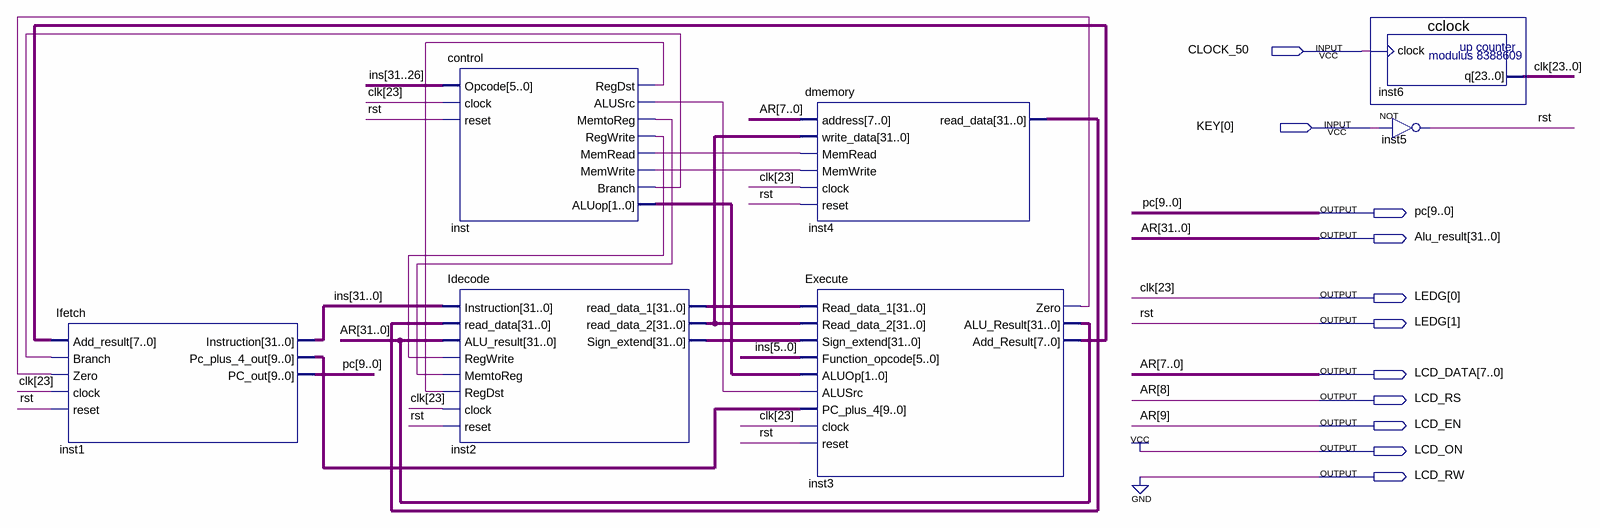
[diagram p0: schematic sheet]
// Quartus schematic MIPS.bdf as structural Verilog: 7 symbols, 11 pins
module MIPS (
  input  CLOCK_50,
  input  [0:0] KEY,
  output [9:0] pc,
  output [31:0] Alu_result,
  output [1:0] LEDG,
  output [7:0] LCD_DATA,
  output LCD_RS,
  output LCD_EN,
  output LCD_ON,
  output LCD_RW
);

  wire inst3_zero, inst_alusrc, inst_branch, inst_memread, inst_memtoreg, inst_memwrite, inst_regdst,
       inst_regwrite;
  wire [1:0] inst_aluop;
  wire [7:0] inst3_add_result;
  wire [9:0] inst1_pc_plus_4_out;
  wire [22:0] clk;
  wire [31:0] ins, inst2_read_data_1, inst2_read_data_2, inst2_sign_extend, inst4_read_data;

  Ifetch inst1 (
    .Add_result(inst3_add_result), .Branch(inst_branch), .Zero(inst3_zero), .clock(LEDG[0]), .reset(LEDG[1]),
    .Instruction(ins), .Pc_plus_4_out(inst1_pc_plus_4_out), .PC_out(pc));
  control inst (
    .Opcode(ins[31:26]), .clock(LEDG[0]), .reset(LEDG[1]), .RegDst(inst_regdst), .ALUSrc(inst_alusrc),
    .MemtoReg(inst_memtoreg), .RegWrite(inst_regwrite), .MemRead(inst_memread), .MemWrite(inst_memwrite),
    .Branch(inst_branch), .ALUop(inst_aluop));
  Idecode inst2 (
    .Instruction(ins), .read_data(inst4_read_data), .ALU_result(Alu_result), .RegWrite(inst_regwrite),
    .MemtoReg(inst_memtoreg), .RegDst(inst_regdst), .clock(LEDG[0]), .reset(LEDG[1]),
    .read_data_1(inst2_read_data_1), .read_data_2(inst2_read_data_2), .Sign_extend(inst2_sign_extend));
  dmemory inst4 (
    .address(Alu_result[7:0]), .write_data(inst2_read_data_2), .MemRead(inst_memread),
    .MemWrite(inst_memwrite), .clock(LEDG[0]), .reset(LEDG[1]), .read_data(inst4_read_data));
  Execute inst3 (
    .Read_data_1(inst2_read_data_1), .Read_data_2(inst2_read_data_2), .Sign_extend(inst2_sign_extend),
    .Function_opcode(ins[5:0]), .ALUOp(inst_aluop), .ALUSrc(inst_alusrc), .PC_plus_4(inst1_pc_plus_4_out),
    .clock(LEDG[0]), .reset(LEDG[1]), .Zero(inst3_zero), .ALU_Result(Alu_result),
    .Add_Result(inst3_add_result));
  cclock inst6 (.clock(CLOCK_50), .q({LEDG[0], clk}));
  not inst5 (LEDG[1], KEY[0]);

  assign LCD_DATA = Alu_result[7:0];
  assign LCD_EN = Alu_result[9];
  assign LCD_ON = 1'b1;
  assign LCD_RS = Alu_result[8];
  assign LCD_RW = 1'b0;

  // Other names for the same wires on the sheet: AR[31:0] = Alu_result; clk[23] = LEDG[0]; rst = LEDG[1]
endmodule
